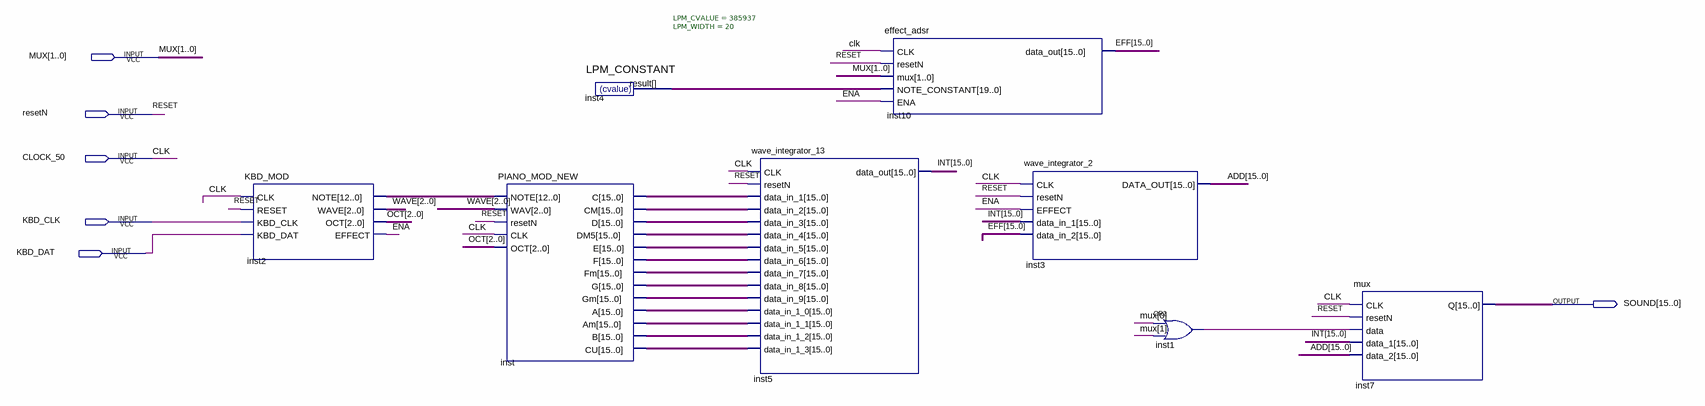
[diagram p0: schematic sheet]
// Quartus schematic PIANO_BLOCK.bdf as structural Verilog: 8 symbols, 6 pins
module PIANO_BLOCK (
  input  [1:0] MUX,
  input  resetN,
  input  CLOCK_50,
  input  KBD_CLK,
  input  KBD_DAT,
  output [15:0] SOUND
);

  wire ENA, inst1_out;
  wire [2:0] OCT, WAVE;
  wire [12:0] inst2_note;
  wire [15:0] ADD, EFF, inst_a, inst_am, inst_b, inst_c, inst_cm, inst_cu, inst_d, inst_dm5, inst_e, inst_f,
       inst_fm, inst_g, inst_gm, INT;
  wire [19:0] inst4_result;

  KBD_MOD inst2 (
    .CLK(CLOCK_50), .RESET(resetN), .KBD_CLK(KBD_CLK), .KBD_DAT(KBD_DAT), .NOTE(inst2_note), .WAVE(WAVE),
    .OCT(OCT), .EFFECT(ENA));
  PIANO_MOD_NEW inst (
    .NOTE(inst2_note), .WAV(WAVE), .resetN(resetN), .CLK(CLOCK_50), .OCT(OCT), .C(inst_c), .CM(inst_cm),
    .D(inst_d), .DM5(inst_dm5), .E(inst_e), .F(inst_f), .Fm(inst_fm), .G(inst_g), .Gm(inst_gm), .A(inst_a),
    .Am(inst_am), .B(inst_b), .CU(inst_cu));
  LPM_CONSTANT #(.LPM_CVALUE(385937), .LPM_WIDTH(20)) inst4 (.result(inst4_result));
  wave_integrator_13 inst5 (
    .CLK(CLOCK_50), .resetN(resetN), .data_in_1(inst_c), .data_in_2(inst_cm), .data_in_3(inst_d),
    .data_in_4(inst_dm5), .data_in_5(inst_e), .data_in_6(inst_f), .data_in_7(inst_fm), .data_in_8(inst_g),
    .data_in_9(inst_gm), .data_in_1_0(inst_a), .data_in_1_1(inst_am), .data_in_1_2(inst_b),
    .data_in_1_3(inst_cu), .data_out(INT));
  effect_adsr inst10 (
    .CLK(CLOCK_50), .resetN(resetN), .mux(MUX), .NOTE_CONSTANT(inst4_result), .ENA(ENA), .data_out(EFF));
  wave_integrator_2 inst3 (
    .CLK(CLOCK_50), .resetN(resetN), .EFFECT(ENA), .data_in_1(INT), .data_in_2(EFF), .DATA_OUT(ADD));
  or inst1 (inst1_out, MUX[0], MUX[1]);
  mux inst7 (.CLK(CLOCK_50), .resetN(resetN), .data(inst1_out), .data_1(INT), .data_2(ADD), .Q(SOUND));

  // Other names for the same wires on the sheet: CLK = CLOCK_50; RESET = resetN
endmodule
